# Altium schematic sheet V3Lights  Sheet.SchDoc
size A4
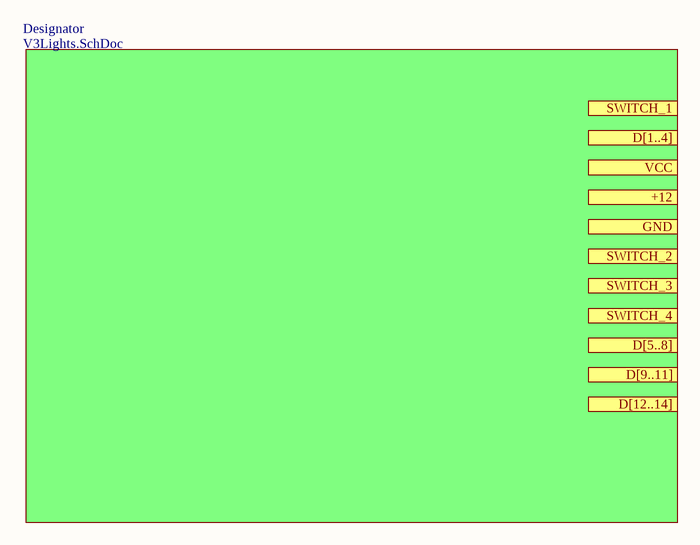
[diagram p0: V3Lights  Sheet.SchDoc]

## Sub-sheets
Designator = V3Lights.SchDoc: no entries

## Ports
+12, D[1..4], D[5..8], D[9..11], D[12..14], GND, SWITCH_1, SWITCH_2, SWITCH_3, SWITCH_4, VCC